# EAGLE schematic schematic (EAGLE 7.5.0)
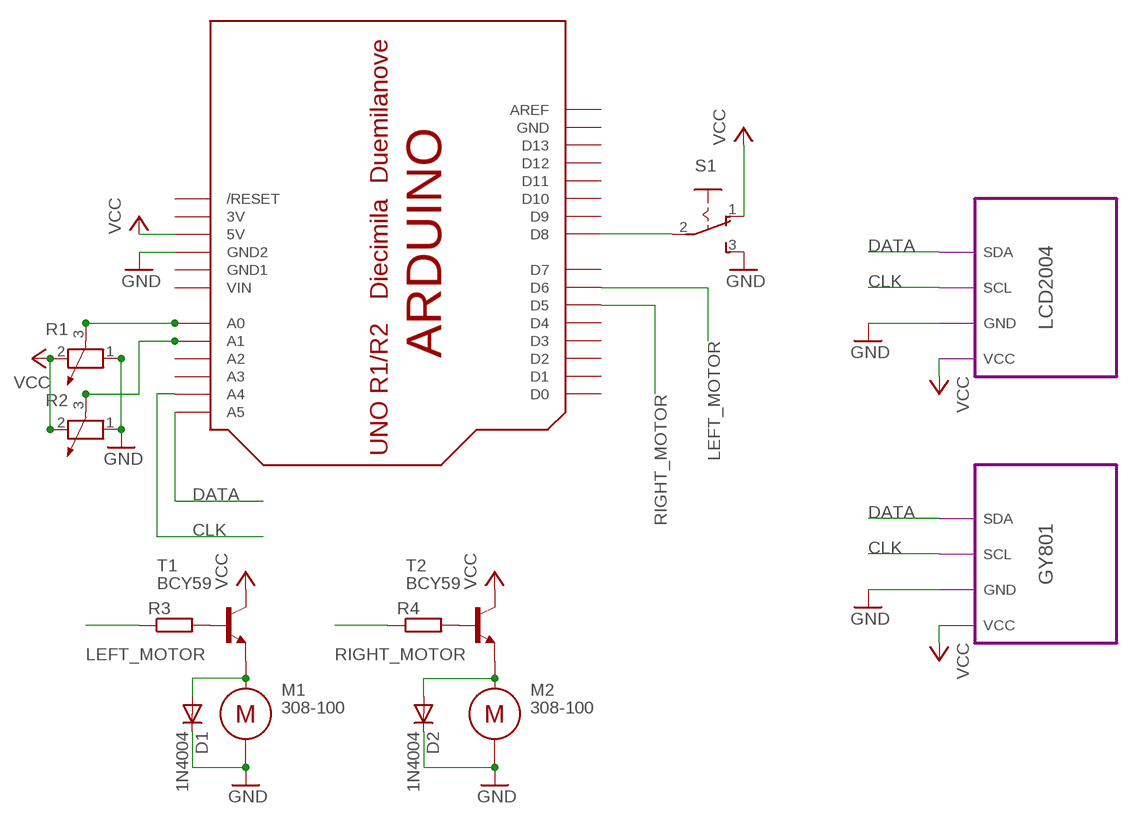
[diagram p0: schematic, sheet 1]

## Parts
D1  1N4004  [DO41-10]
D2  1N4004  [DO41-10]
M1  308-100  [308-100]
M2  308-100  [308-100]
R1  POTENTIOMETER_PT-10  [PT-10]
R2  POTENTIOMETER_PT-10  [PT-10]
R3  R-EU_0204/5  [0204/5]
R4  R-EU_0204/5  [0204/5]
S1  255SB  [255SB]
T1  BCY59  [TO18]
T2  BCY59  [TO18]
U$1  ARDUINOUNO  [ARDUINO]

## Module instances
GY801 = GY801 (part numbers offset by 100)
LCD2004 = GY801

## Nets
CLK: U$1.A4 ; port LCD2004.SCL GY801.SCL
DATA: U$1.A5 ; port LCD2004.SDA GY801.SDA
GND: D1.C D2.C M1.NEG M2.NEG R1.1 R2.1 S1.3(S) U$1.GND2 ; port LCD2004.GND GY801.GND
LEFT_MOTOR: R3.1 U$1.D6
N$1: R3.2 T1.2(B)
N$2: R4.2 T2.2(B)
N$3: M1.POS T1.1(E)
N$4: D1.A
N$5: M2.POS T2.1(E)
N$6: D2.A
N$7: S1.2(P) U$1.D8
N$10: R1.3 U$1.A0
N$11: R2.3 U$1.A1
RIGHT_MOTOR: R4.1 U$1.D5
VCC: R1.2 R2.2 S1.1(O) T1.3(C) T2.3(C) U$1.5V ; port LCD2004.VCC GY801.VCC
Unconnected: U$1.A2 U$1.A3 U$1.AREF U$1.D0 U$1.D1 U$1.D2 U$1.D3 U$1.D4 U$1.D7 U$1.D9 U$1.D10 U$1.D11 U$1.D12 U$1.D13 U$1.RESET(/RESET)

## Power pins joined to a net without a drawn wire
3V: U$1.3V
GND: U$1.GND
GND1: U$1.GND1
VIN: U$1.VIN

## Library data of the parts
D1 D2 = adafruit:1N4004: DIODE General purpose 1N400x type rectifier (With bigger pads) http://www.ladyada.net/library/pcb/eaglelibrary.html
M1 M2 = motor:308-100: Pico Vibe 8mm Vibration Motor - 3mm Type; PRECISION_MICRODRIVES: 308-100
R1 R2 = rcl:POTENTIOMETER_: Potentiometer
R3 R4 = rcl:R-EU_: RESISTOR, European symbol
S1 = switch:255SB: SLIDING SWITCH Distributor Buerklin, 11G810
T1 T2 = transistor-neu-to92:BCY59: NPN TRANSISTOR
U$1 = adafruit:ARDUINO: Arduino Diecimila/Duemilanove Make a shield with ease, this package has all the named pins as well as the two mounting drill holes and an outline of the USB and DC power connector. The outline is on the DIMENSION layer, so if your board house uses it they will cut the outline to match. http://www.ladyada.net/library/pcb/eaglelibrary.html

## Module GY801
Ports: VCC(io) GND(io) SCL(io) SDA(io)

### Library data of the parts